# Altium project _autosave-DebugBoard.PrjPcb
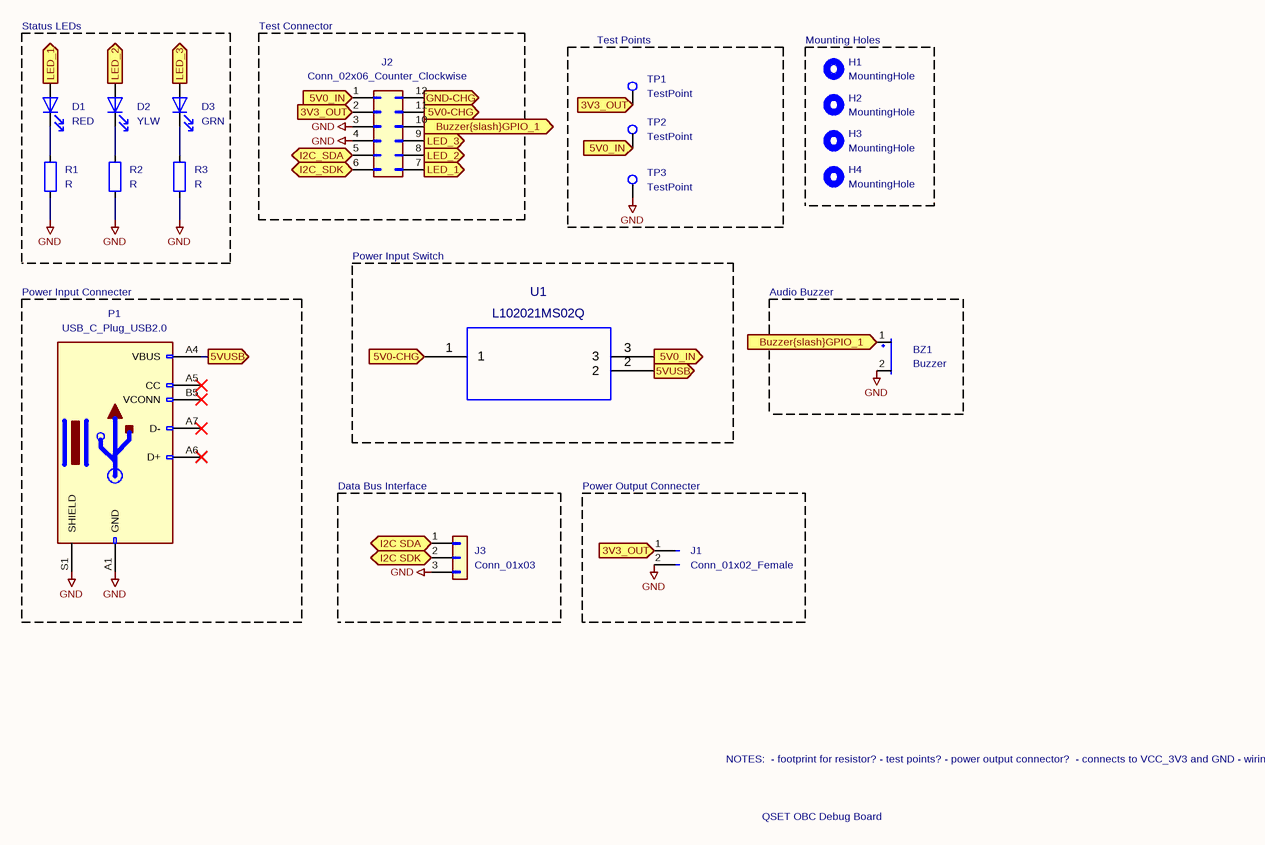
[diagram p0: _autosave-DebugBoard.SchDoc]
2 sheets, 38 parts. Net scope: flat (ports and power ports of the same name join across sheets).
Board files: DebugBoard.PcbDoc, DebugBoard(1).PcbDoc
Sheets:
  _autosave-DebugBoard.SchDoc
  DebugBoard.SchDoc

## Sheet _autosave-DebugBoard.SchDoc
size 297 x 209 mm

### Parts
(Parts that share a designator on the sheet are numbered #1, #2 ... from top to bottom, then left to right.)
BZ1#1  Buzzer  [XDCR_CMT-8504-100-SMT-TR]
D1#1  RED  [LED_D3.0mm]
D2#1  YLW  [LED_D3.0mm]
D3#1  GRN  [LED_D3.0mm]
H1#1  MountingHole  [MountingHole_2.2mm_M2_Pad]
H2#1  MountingHole  [MountingHole_2.2mm_M2_Pad]
H3#1  MountingHole  [MountingHole_2.2mm_M2_Pad]
H4#1  MountingHole  [MountingHole_2.2mm_M2_Pad]
J1#1  Conn_01x02_Female  [PinSocket_1x02_P2.54mm_Horizontal]
J2#1  Conn_02x06_Counter_Clockwise  [PinHeader_2x06_P2.54mm_Horizontal]
J3#1  Conn_01x03  [PinHeader_1x03_P2.54mm_Horizontal]
P1#1  USB_C_Plug_USB2.0  [USB_C_Receptacle_GCT_USB4085]
R1#1  R  [R_Axial_DIN0207_L6.3mm_D2.5mm_P7.62mm_Horizontal]
R2#1  R  [R_Axial_DIN0207_L6.3mm_D2.5mm_P7.62mm_Horizontal]
R3#1  R  [R_Axial_DIN0207_L6.3mm_D2.5mm_P7.62mm_Horizontal]
TP1#1  TestPoint  [TestPoint_Pad_2.0x2.0mm]
TP2#1  TestPoint  [TestPoint_Pad_2.0x2.0mm]
TP3#1  TestPoint  [TestPoint_Pad_2.0x2.0mm]
U1#1  L102021MS02Q  [L102021MS02Q]

### Blocks framed on the sheet
Status LEDs /: D1#1 D2#1 D3#1 R1#1 R2#1 R3#1
Test Connector: J2#1
Test Points: TP1#1 TP2#1 TP3#1
Mounting Holes: H1#1 H2#1 H3#1 H4#1
Power Input Switch /: U1#1
Power Input Connecter: P1#1
Audio Buzzer /: BZ1#1
Data Bus Interface: J3#1

### Ports
3V3_OUT (out), 5V0-CHG (in), 5V0_IN (in), 5V0_IN (out), 5VUSB (out), Buzzer{slash}GPIO_1 (in), GND-CHG (in), I2C SDA (bidir), I2C SDK (bidir), I2C_SDA (bidir), I2C_SDK (bidir), LED_1 (in), LED_2 (in), LED_3 (in)

### Nets
GND: BZ1#1.2(+) J1#1.2(Pin_2) J2#1.3(Pin_3) J2#1.4(Pin_4) J3#1.3(Pin_3) P1#1.A1(GND) P1#1.S1(SHIELD) R1#1.2 R2#1.2 R3#1.2 TP3#1.1
3V3_OUT: J1#1.1(Pin_1) J2#1.2(Pin_2) TP1#1.1 ; port 3V3_OUT
5V0-CHG: J2#1.11(Pin_11) U1#1.1 ; port 5V0-CHG
5V0_IN: J2#1.1(Pin_1) TP2#1.1 U1#1.3 ; port 5V0_IN
5VUSB: P1#1.A4(VBUS) U1#1.2 ; port 5VUSB
Buzzer{slash}GPIO_1: BZ1#1.1(-) J2#1.10(Pin_10) ; port Buzzer{slash}GPIO_1
GND-CHG: J2#1.12(Pin_12) ; port GND-CHG
I2C SDA: J3#1.1(Pin_1) ; port I2C SDA
I2C SDK: J3#1.2(Pin_2) ; port I2C SDK
I2C_SDA: J2#1.5(Pin_5) ; port I2C_SDA
I2C_SDK: J2#1.6(Pin_6) ; port I2C_SDK
LED_1: D1#1.2(A) J2#1.7(Pin_7) ; port LED_1
LED_2: D2#1.2(A) J2#1.8(Pin_8) ; port LED_2
LED_3: D3#1.2(A) J2#1.9(Pin_9) ; port LED_3
NetD1#1_1: D1#1.1(K) R1#1.1
NetD2#1_1: D2#1.1(K) R2#1.1
NetD3#1_1: D3#1.1(K) R3#1.1

Not connected (* = marked no-connect by the designer): P1#1 A5(CC)* A6(D+)* A7(D-)* A9(VBUS) A12(GND) B1(GND) B4(VBUS) B5(VCONN)* B9(VBUS) B12(GND)

### Notes on the sheet
- Power Output Connecter
- NOTES:
  - footprint for resistor?
  - test points?
  - power output connector?
  - connects to VCC_3V3 and GND
  - wiring of the usb-c for power?
  - wiring everything else?
- QSET OBC Debug Board
- 1
- 2
- 3
- 4
- 5
- 6
- A
- B
- C
- D
- Title:
- File: _autosave-DebugBoard.kicad_sch
- Sheet: /
- KiCad E.D.A.  kicad (5.1.4)-1
- Size: A4
- Date:
- Rev:
- Id: 1/1

### Library data of the parts
D1#1 D2#1 D3#1 = LED: Footprint: LED_THT:LED_D3.0mm
  D1#1: Value: RED
  D2#1: Value: YLW
  D3#1: Value: GRN
BZ1#1 = Buzzer: Value: Buzzer; Footprint: Daughterboard_footprints:XDCR_CMT-8504-100-SMT-TR
H1#1 H2#1 H3#1 H4#1 = MountingHole: Value: MountingHole; Footprint: MountingHole:MountingHole_2.2mm_M2_Pad
J1#1 = Conn_01x02_Female: Value: Conn_01x02_Female; Footprint: Connector_PinSocket_2.54mm:PinSocket_1x02_P2.54mm_Horizontal
J2#1 = Conn_02x06_Counter_Clockwise: Value: Conn_02x06_Counter_Clockwise; Footprint: Connector_PinHeader_2.54mm:PinHeader_2x06_P2.54mm_Horizontal
J3#1 = Conn_01x03: Value: Conn_01x03; Footprint: Connector_PinHeader_2.54mm:PinHeader_1x03_P2.54mm_Horizontal
P1#1 = USB_C_Plug_USB2.0: Value: USB_C_Plug_USB2.0; Footprint: Connector_USB:USB_C_Receptacle_GCT_USB4085
R1#1 R2#1 R3#1 = R: Value: R; Footprint: Resistor_THT:R_Axial_DIN0207_L6.3mm_D2.5mm_P7.62mm_Horizontal
TP1#1 TP2#1 TP3#1 = TestPoint: Value: TestPoint; Footprint: TestPoint:TestPoint_Pad_2.0x2.0mm
U1#1 = L102021MS02Q: Value: L102021MS02Q; Footprint: Daughterboard_footprints:L102021MS02Q

## Sheet DebugBoard.SchDoc
size 297 x 209 mm
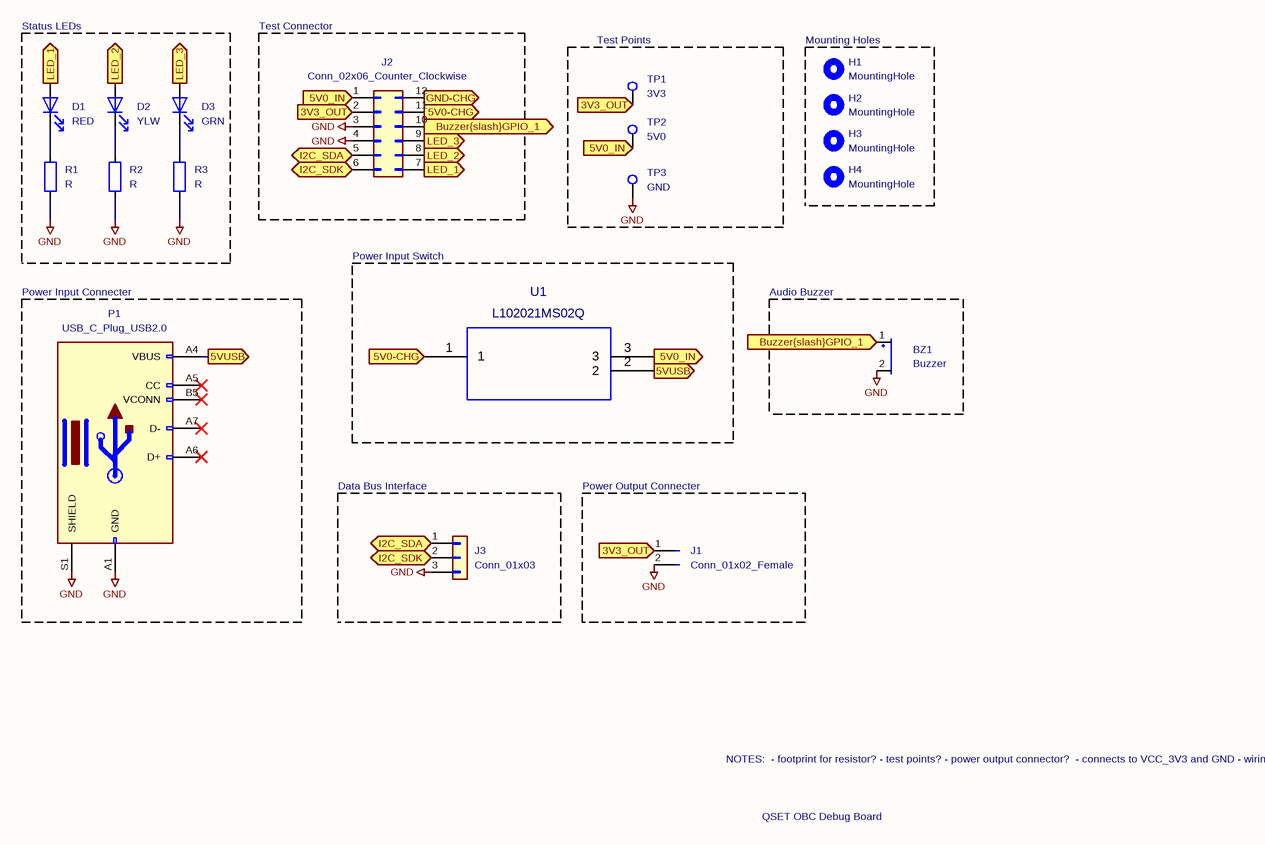
[diagram p1: DebugBoard.SchDoc]

### Parts
(Parts that share a designator on the sheet are numbered #1, #2 ... from top to bottom, then left to right.)
BZ1#2  Buzzer  [XDCR_CMT-8504-100-SMT-TR]
D1#2  RED  [LED_D3.0mm]
D2#2  YLW  [LED_D3.0mm]
D3#2  GRN  [LED_D3.0mm]
H1#2  MountingHole  [MountingHole_2.2mm_M2_Pad]
H2#2  MountingHole  [MountingHole_2.2mm_M2_Pad]
H3#2  MountingHole  [MountingHole_2.2mm_M2_Pad]
H4#2  MountingHole  [MountingHole_2.2mm_M2_Pad]
J1#2  Conn_01x02_Female  [PinSocket_1x02_P2.54mm_Horizontal]
J2#2  Conn_02x06_Counter_Clockwise  [PinHeader_2x06_P2.54mm_Horizontal]
J3#2  Conn_01x03  [PinHeader_1x03_P2.54mm_Horizontal]
P1#2  USB_C_Plug_USB2.0  [USB_C_Receptacle_GCT_USB4085]
R1#2  R  [R_Axial_DIN0207_L6.3mm_D2.5mm_P7.62mm_Horizontal]
R2#2  R  [R_Axial_DIN0207_L6.3mm_D2.5mm_P7.62mm_Horizontal]
R3#2  R  [R_Axial_DIN0207_L6.3mm_D2.5mm_P7.62mm_Horizontal]
TP1#2  3V3  [TestPoint_Pad_2.0x2.0mm]
TP2#2  5V0  [TestPoint_Pad_2.0x2.0mm]
TP3#2  GND  [TestPoint_Pad_2.0x2.0mm]
U1#2  L102021MS02Q  [L102021MS02Q]

### Blocks framed on the sheet
Status LEDs /: D1#2 D2#2 D3#2 R1#2 R2#2 R3#2
Test Connector: J2#2
Test Points: TP1#2 TP2#2 TP3#2
Mounting Holes: H1#2 H2#2 H3#2 H4#2
Power Input Switch /: U1#2
Power Input Connecter: P1#2
Audio Buzzer /: BZ1#2
Data Bus Interface: J3#2

### Ports
3V3_OUT (out), 5V0-CHG (in), 5V0_IN (in), 5V0_IN (out), 5VUSB (out), Buzzer{slash}GPIO_1 (in), GND-CHG (in), I2C_SDA (bidir), I2C_SDK (bidir), LED_1 (in), LED_2 (in), LED_3 (in)

### Nets
GND: BZ1#2.2(+) J1#2.2(Pin_2) J2#2.3(Pin_3) J2#2.4(Pin_4) J3#2.3(Pin_3) P1#2.A1(GND) P1#2.S1(SHIELD) R1#2.2 R2#2.2 R3#2.2 TP3#2.1
3V3_OUT: J1#2.1(Pin_1) J2#2.2(Pin_2) TP1#2.1 ; port 3V3_OUT
5V0-CHG: J2#2.11(Pin_11) U1#2.1 ; port 5V0-CHG
5V0_IN: J2#2.1(Pin_1) TP2#2.1 U1#2.3 ; port 5V0_IN
5VUSB: P1#2.A4(VBUS) U1#2.2 ; port 5VUSB
Buzzer{slash}GPIO_1: BZ1#2.1(-) J2#2.10(Pin_10) ; port Buzzer{slash}GPIO_1
GND-CHG: J2#2.12(Pin_12) ; port GND-CHG
I2C_SDA: J2#2.5(Pin_5) J3#2.1(Pin_1) ; port I2C_SDA
I2C_SDK: J2#2.6(Pin_6) J3#2.2(Pin_2) ; port I2C_SDK
LED_1: D1#2.2(A) J2#2.7(Pin_7) ; port LED_1
LED_2: D2#2.2(A) J2#2.8(Pin_8) ; port LED_2
LED_3: D3#2.2(A) J2#2.9(Pin_9) ; port LED_3
NetD1#2_1: D1#2.1(K) R1#2.1
NetD2#2_1: D2#2.1(K) R2#2.1
NetD3#2_1: D3#2.1(K) R3#2.1

Not connected (* = marked no-connect by the designer): P1#2 A5(CC)* A6(D+)* A7(D-)* A9(VBUS) A12(GND) B1(GND) B4(VBUS) B5(VCONN)* B9(VBUS) B12(GND)

### Notes on the sheet
- Power Output Connecter
- NOTES:
  - footprint for resistor?
  - test points?
  - power output connector?
  - connects to VCC_3V3 and GND
  - wiring of the usb-c for power?
  - wiring everything else?
- QSET OBC Debug Board
- 1
- 2
- 3
- 4
- 5
- 6
- A
- B
- C
- D
- Title:
- File: DebugBoard.kicad_sch
- Sheet: /
- KiCad E.D.A.  kicad (5.1.4)-1
- Size: A4
- Date:
- Rev:
- Id: 1/1

### Library data of the parts
D1#2 D2#2 D3#2 = LED: Footprint: LED_THT:LED_D3.0mm
  D1#2: Value: RED
  D2#2: Value: YLW
  D3#2: Value: GRN
TP1#2 TP2#2 TP3#2 = TestPoint: Footprint: TestPoint:TestPoint_Pad_2.0x2.0mm
  TP1#2: Value: 3V3
  TP2#2: Value: 5V0
  TP3#2: Value: GND
BZ1#2 = Buzzer: Value: Buzzer; Footprint: Daughterboard_footprints:XDCR_CMT-8504-100-SMT-TR
H1#2 H2#2 H3#2 H4#2 = MountingHole: Value: MountingHole; Footprint: MountingHole:MountingHole_2.2mm_M2_Pad
J1#2 = Conn_01x02_Female: Value: Conn_01x02_Female; Footprint: Connector_PinSocket_2.54mm:PinSocket_1x02_P2.54mm_Horizontal
J2#2 = Conn_02x06_Counter_Clockwise: Value: Conn_02x06_Counter_Clockwise; Footprint: Connector_PinHeader_2.54mm:PinHeader_2x06_P2.54mm_Horizontal
J3#2 = Conn_01x03: Value: Conn_01x03; Footprint: Connector_PinHeader_2.54mm:PinHeader_1x03_P2.54mm_Horizontal
P1#2 = USB_C_Plug_USB2.0: Value: USB_C_Plug_USB2.0; Footprint: Connector_USB:USB_C_Receptacle_GCT_USB4085
R1#2 R2#2 R3#2 = R: Value: R; Footprint: Resistor_THT:R_Axial_DIN0207_L6.3mm_D2.5mm_P7.62mm_Horizontal
U1#2 = L102021MS02Q: Value: L102021MS02Q; Footprint: qset-footprints:L102021MS02Q

## Nets that join several sheets
GND: _autosave-DebugBoard (11 pins), DebugBoard (11 pins)
3V3_OUT: _autosave-DebugBoard (J1#1.1 J2#1.2 TP1#1.1), DebugBoard (J1#2.1 J2#2.2 TP1#2.1)
5V0-CHG: _autosave-DebugBoard (J2#1.11 U1#1.1), DebugBoard (J2#2.11 U1#2.1)
5V0_IN: _autosave-DebugBoard (J2#1.1 TP2#1.1 U1#1.3), DebugBoard (J2#2.1 TP2#2.1 U1#2.3)
5VUSB: _autosave-DebugBoard (P1#1.A4 U1#1.2), DebugBoard (P1#2.A4 U1#2.2)
Buzzer{slash}GPIO_1: _autosave-DebugBoard (BZ1#1.1 J2#1.10), DebugBoard (BZ1#2.1 J2#2.10)
GND-CHG: _autosave-DebugBoard (J2#1.12), DebugBoard (J2#2.12)
I2C_SDA: _autosave-DebugBoard (J2#1.5), DebugBoard (J2#2.5 J3#2.1)
I2C_SDK: _autosave-DebugBoard (J2#1.6), DebugBoard (J2#2.6 J3#2.2)
LED_1: _autosave-DebugBoard (D1#1.2 J2#1.7), DebugBoard (D1#2.2 J2#2.7)
LED_2: _autosave-DebugBoard (D2#1.2 J2#1.8), DebugBoard (D2#2.2 J2#2.8)
LED_3: _autosave-DebugBoard (D3#1.2 J2#1.9), DebugBoard (D3#2.2 J2#2.9)